# Altium schematic sheet 11_HDMI_CON.SchDoc
size A4
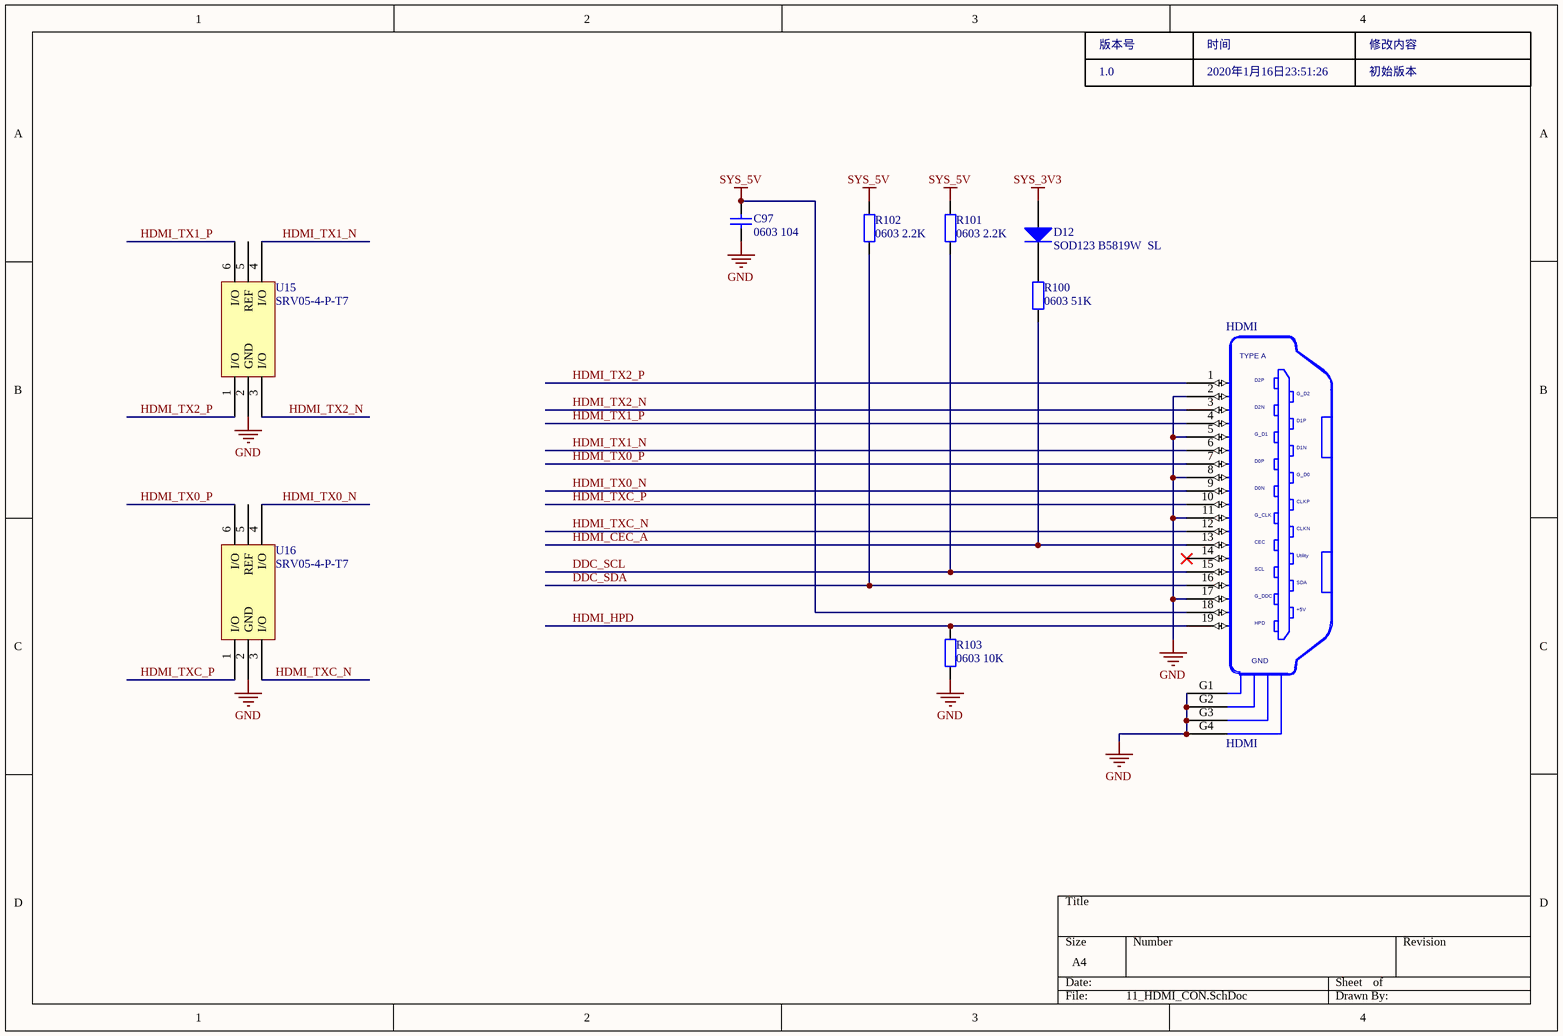
[diagram p0: 11_HDMI_CON.SchDoc]

## Parts
C97  0603 104  [LC-0603_C]
D12  SOD123 B5819W  SL  [LC-SOD-123]
HDMI  HDMI  [HDMI]
R100  0603 51K  [LC-0603_R]
R101  0603 2.2K  [LC-0603_R]
R102  0603 2.2K  [LC-0603_R]
R103  0603 10K  [LC-0603_R]
U15  SRV05-4-P-T7  [LC-SOT-23-6]
U16  SRV05-4-P-T7  [LC-SOT-23-6]

## Nets
GND: C97.2 HDMI.2(D2GND) HDMI.5(D1GND) HDMI.8(D0GND) HDMI.11(CKGND) HDMI.17(DDCGND) HDMI.G1(GND1) HDMI.G2(GND2) HDMI.G3(GND3) HDMI.G4(GND4) R103.1 U15.2(GND) U16.2(GND)
SYS_3V3: D12.1(A)
SYS_5V: C97.1 HDMI.18(+5V) R101.2 R102.2
DDC_SCL: HDMI.15(SCL) R101.1
DDC_SDA: HDMI.16(SDA) R102.1
HDMI_CEC_A: HDMI.13(CEC) R100.1
HDMI_HPD: HDMI.19(HPD) R103.2
HDMI_TX0_N: HDMI.9(D0-) U16.4(I/O)
HDMI_TX0_P: HDMI.7(D0+) U16.6(I/O)
HDMI_TX1_N: HDMI.6(D1-) U15.4(I/O)
HDMI_TX1_P: HDMI.4(D1+) U15.6(I/O)
HDMI_TX2_N: HDMI.3(D2-) U15.3(I/O)
HDMI_TX2_P: HDMI.1(D2+) U15.1(I/O)
HDMI_TXC_N: HDMI.12(CK-) U16.3(I/O)
HDMI_TXC_P: HDMI.10(CK+) U16.1(I/O)
NetD12_2: D12.2(K) R100.2

Not connected (* = marked no-connect by the designer): HDMI 14(UTILITY)*; U15 5(REF); U16 5(REF)

## Notes on the sheet
- 版本号
- 1.0
- 2020年1月16日23:51:26
- 时间
- 修改内容
- 初始版本
- (in symbol HDMI) TYPE A; D2P; G_D2; D2N; D1P; G_D1; D1N; D0P; G_D0; D0N; CLKP; G_CLK; CLKN; Utility; G_DDC; GND

## Library data of the parts
C97 = 0603 1.5nF (152) 10% 50V: 贴片电容; ComponentLink1Description: 供应商链接; ComponentLink1URL: http://www.szlcsc.com/product/details_1947.html; Package: 0603; Supplier: LC; SuppliersPartNumber: C1595
D12 = SOD-123 B5819W  SL: 肖特基二极管; ComponentLink1Description: 供应商链接; ComponentLink1URL: http://www.szlcsc.com/product/details_9093.html; Package: SOD-123; Supplier: LC; SuppliersPartNumber: C8598
R100-R103 = 0603 1.1KΩ (1101) 1%: 贴片电阻; ComponentLink1Description: 供应商链接; ComponentLink1URL: http://www.szlcsc.com/product/details_23491.html; Package: 0603; Supplier: LC; SuppliersPartNumber: C22764
U15 U16 = SRV05-4-P-T7: TVS; ComponentLink1Description: 供应商链接; ComponentLink1URL: http://www.szlcsc.com/product/details_86537.html; Package: SOT-23-6; Supplier: LC; SuppliersPartNumber: C85364